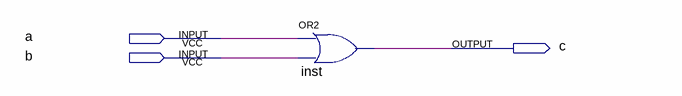
[diagram p0: schematic sheet]
// Quartus schematic exampleOR.bdf as structural Verilog: 1 symbols, 3 pins
module exampleOR (
  input  a,
  input  b,
  output c
);

  or inst (c, a, b);
endmodule
